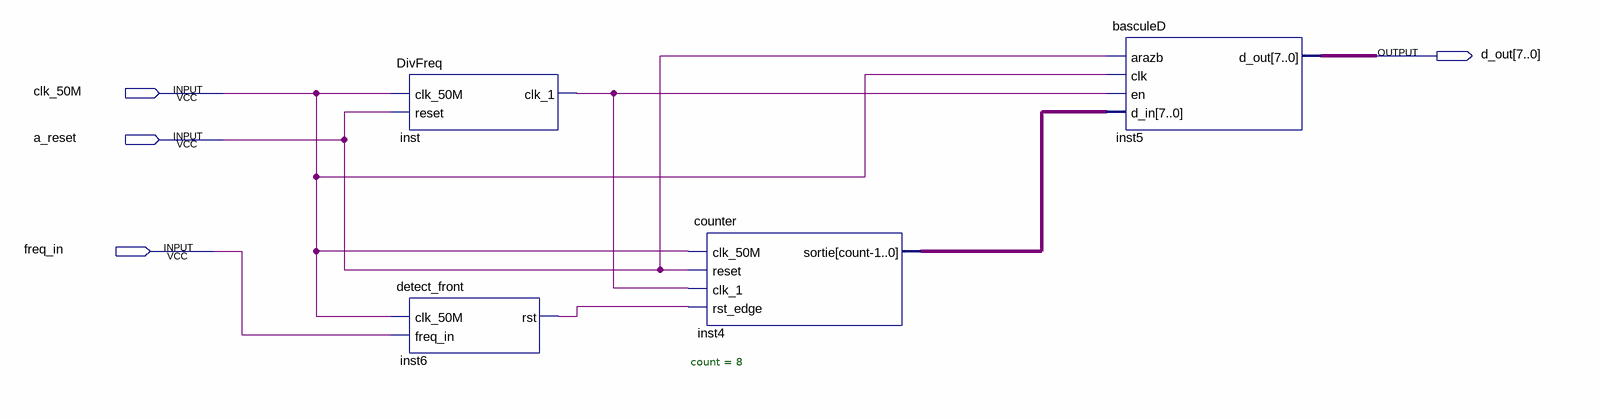
[diagram p0: schematic sheet]
// Quartus schematic anemometre_component.bdf as structural Verilog: 4 symbols, 4 pins
module anemometre_component (
  input  clk_50M,
  input  a_reset,
  input  freq_in,
  output [7:0] d_out
);

  wire inst6_rst, inst_clk_1;
  wire [7:0] inst4_sortie;

  DivFreq inst (.clk_50M(clk_50M), .reset(a_reset), .clk_1(inst_clk_1));
  detect_front inst6 (.clk_50M(clk_50M), .freq_in(freq_in), .rst(inst6_rst));
  counter #(.count(8)) inst4 (
    .clk_50M(clk_50M), .reset(a_reset), .clk_1(inst_clk_1), .rst_edge(inst6_rst), .sortie(inst4_sortie));
  basculeD inst5 (.arazb(a_reset), .clk(clk_50M), .en(inst_clk_1), .d_in(inst4_sortie), .d_out(d_out));
endmodule
